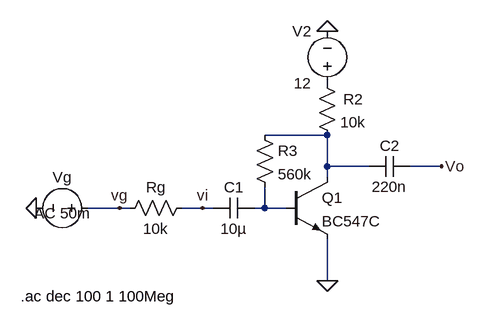
[diagram p0: schematic BC547B.asc]
BC547B.asc, the LTspice schematic file:
Version 4
SHEET 1 880 680
WIRE 224 0 128 0
WIRE 224 48 224 0
WIRE 288 48 224 48
WIRE 400 48 352 48
WIRE 224 64 224 48
WIRE -96 112 -144 112
WIRE -80 112 -96 112
WIRE 32 112 0 112
WIRE 48 112 32 112
WIRE 128 112 128 80
WIRE 128 112 112 112
WIRE 160 112 128 112
WIRE 224 224 224 160
FLAG 224 224 0
FLAG 400 48 Vo
FLAG -224 112 0
FLAG 224 -160 0
FLAG 32 112 vi
FLAG -96 112 vg
SYMBOL res 16 96 R90
WINDOW 0 0 56 VBottom 2
WINDOW 3 32 56 VTop 2
SYMATTR InstName Rg
SYMATTR Value 10k
SYMBOL cap 112 96 R90
WINDOW 0 0 32 VBottom 2
WINDOW 3 32 32 VTop 2
SYMATTR InstName C1
SYMATTR Value 10µ
SYMBOL res 208 -96 R0
WINDOW 0 41 41 Left 2
SYMATTR InstName R2
SYMATTR Value 10k
SYMBOL npn 160 64 R0
SYMATTR InstName Q1
SYMATTR Value BC547C
SYMBOL res 112 -16 R0
SYMATTR InstName R3
SYMATTR Value 560k
SYMBOL voltage -128 112 R90
WINDOW 0 -32 56 VBottom 2
WINDOW 3 -4 56 VBottom 2
WINDOW 123 24 56 VBottom 2
WINDOW 39 0 0 Left 0
SYMATTR InstName Vg
SYMATTR Value ""
SYMATTR Value2 AC 50m
SYMBOL voltage 224 -64 R180
WINDOW 0 24 96 Left 2
WINDOW 3 24 16 Left 2
WINDOW 123 0 0 Left 0
WINDOW 39 0 0 Left 0
SYMATTR InstName V2
SYMATTR Value 12
SYMBOL cap 352 32 R90
WINDOW 0 0 32 VBottom 2
WINDOW 3 32 32 VTop 2
SYMATTR InstName C2
SYMATTR Value 220n
TEXT -248 248 Left 2 !.ac dec 100 1 100Meg

The netlist it stands for:
* BC547B.asc
Rg vi vg 10k
C1 N002 vi 10µ
R2 P001 N001 10k
Q1 N001 N002 0 0 BC547C
R3 N001 N002 560k
Vg vg 0 AC 50m
V2 P001 0 12
C2 Vo N001 220n
.model NPN NPN
.model PNP PNP
.lib standard.bjt
.ac dec 100 1 100Meg
.backanno
.end